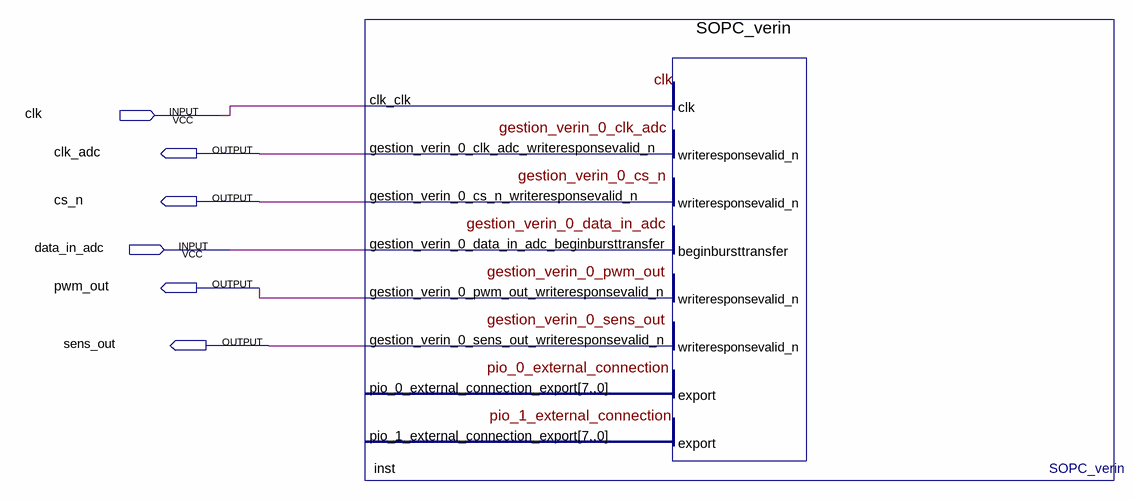
[diagram p0: schematic sheet]
// Quartus schematic bloc_gestion_verin.bdf as structural Verilog: 1 symbols, 6 pins
module bloc_gestion_verin (
  input  clk,
  input  data_in_adc,
  output clk_adc,
  output cs_n,
  output pwm_out,
  output sens_out
);

  SOPC_verin inst (
    .clk_clk(clk), .gestion_verin_0_data_in_adc_beginbursttransfer(data_in_adc),
    .gestion_verin_0_clk_adc_writeresponsevalid_n(clk_adc), .gestion_verin_0_cs_n_writeresponsevalid_n(cs_n),
    .gestion_verin_0_pwm_out_writeresponsevalid_n(pwm_out),
    .gestion_verin_0_sens_out_writeresponsevalid_n(sens_out));  // open: pio_0_external_connection_export, pio_1_external_connection_export
endmodule
